# Altium schematic sheet Data-Power.SchDoc
size Letter; SheetNumber: 3; SheetTotal: 3; SPICEModelCacheLQOFTWCY: <root> / <DocumentId>LQOFTWCY</DocumentId> / </root>; SheetName: Data & Power
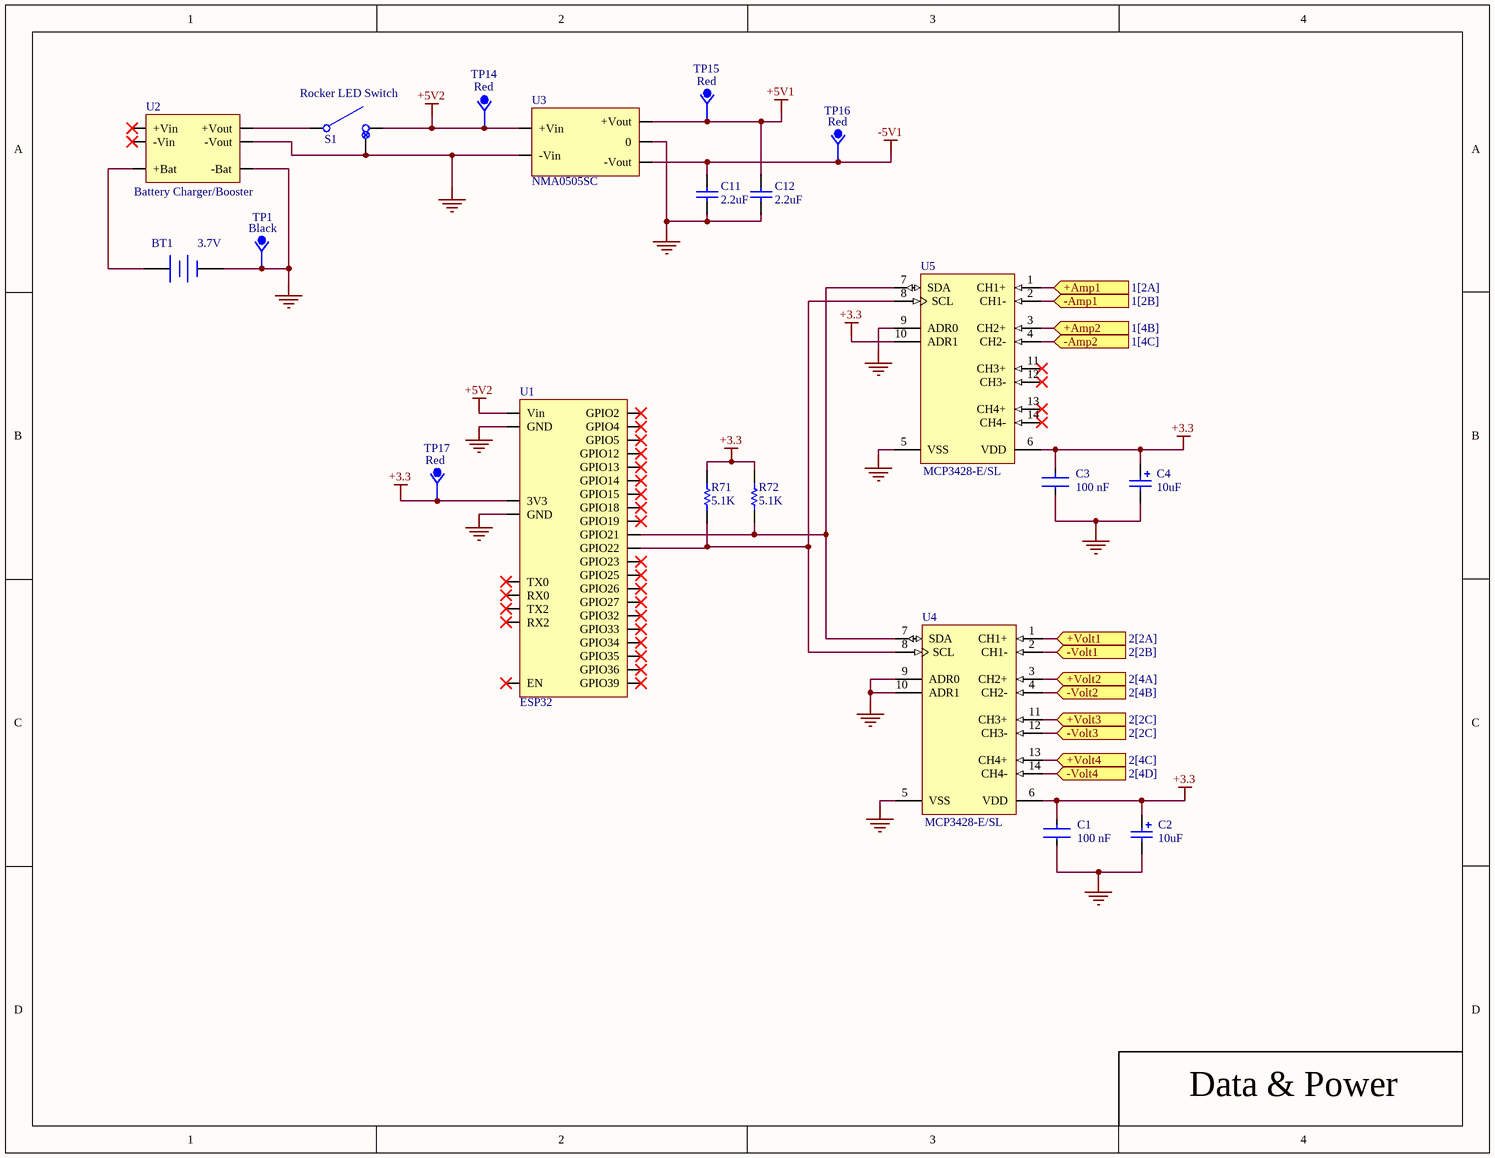
[diagram p0: Data-Power.SchDoc]

## Parts
BT1  Voltage: 3.7V  [BAT-2]  (hidden comment: 3.7V Battery)
C1  value 100 nF  [FP-CC0805-0_85-MFG]  (hidden comment: 100nF)
C2  value 10uF  [0805 Tant Cap]  (hidden comment: TCTP1C106M8R)
C3  value 100 nF  [FP-CC0805-0_85-MFG]  (hidden comment: 100nF)
C4  value 10uF  [0805 Tant Cap]  (hidden comment: TCTP1C106M8R)
C11  2.2uF  [CAPC2013X135X50ML10T20]
C12  2.2uF  [CAPC2013X135X50ML10T20]
R71  value 5.1K  [0805 Res]  (hidden comment: 5.11k Ohm)
R72  value 5.1K  [0805 Res]  (hidden comment: 5.11k Ohm)
S1  Rocker LED Switch  [SW]
TP1  Color: Black  [BlackTP]  (hidden comment: TP (Black))
TP14  Color: Red  [RedTP]  (hidden comment: TP (Red))
TP15  Color: Red  [RedTP]  (hidden comment: TP (Red))
TP16  Color: Red  [RedTP]  (hidden comment: TP (Red))
TP17  Color: Red  [RedTP]  (hidden comment: TP (Red))
U1  ESP32  [ESP32]
U2  Battery Charger/Booster  [Batt Chrg/Bst]
U3  DC DC Converter  [NMA0505SC]  (value not drawn)
U4  Manufacturer Part Number: MCP3428-E/SL  [SOIC-SL14_N]  (hidden comment: 4Ch ADC)
U5  Manufacturer Part Number: MCP3428-E/SL  [SOIC-SL14_N]  (hidden comment: 4Ch ADC)

## Ports
+Amp1 (in, see 1[2A]), +Amp2 (in, see 1[4B]), +Volt1 (in, see 2[2A]), +Volt2 (in, see 2[4A]), +Volt3 (in, see 2[2C]), +Volt4 (in, see 2[4C]), -Amp1 (in, see 1[2B]), -Amp2 (in, see 1[4C]), -Volt1 (in, see 2[2B]), -Volt2 (in, see 2[4B]), -Volt3 (in, see 2[2C]), -Volt4 (in, see 2[4D])

## Nets
+3.3: C1.1 C2.1 C3.1 C4.1 R71.2 R72.2 TP17.1(TP) U1.?3(3V3) U4.6(VDD) U5.6(VDD) U5.10(ADR1)
+5V1: C12.2 TP15.1(TP) U3.?4(+Vout)
+5V2: S1.?2 TP14.1(TP) U1.?1(Vin) U3.?1(+Vin)
-5V1: C11.2 TP16.1(TP) U3.?5(-Vout)
GND: BT1.2(-) C1.2 C2.2 C3.2 C4.2 C11.1 C12.1 S1.?3 TP1.1(TP) U1.?2(GND) U1.?4(GND) U2.?2(-Bat) U2.?4(-Vout) U3.?2(-Vin) U3.?3(0) U4.5(VSS) U4.9(ADR0) U4.10(ADR1) U5.5(VSS) U5.9(ADR0)
+Amp1: U5.1(CH1+) ; port +Amp1
+Amp2: U5.3(CH2+) ; port +Amp2
+Volt1: U4.1(CH1+) ; port +Volt1
+Volt2: U4.3(CH2+) ; port +Volt2
+Volt3: U4.11(CH3+) ; port +Volt3
+Volt4: U4.13(CH4+) ; port +Volt4
-Amp1: U5.2(CH1-) ; port -Amp1
-Amp2: U5.4(CH2-) ; port -Amp2
-Volt1: U4.2(CH1-) ; port -Volt1
-Volt2: U4.4(CH2-) ; port -Volt2
-Volt3: U4.12(CH3-) ; port -Volt3
-Volt4: U4.14(CH4-) ; port -Volt4
NetBT1_1: BT1.1(+) U2.?1(+Bat)
NetR71_1: R71.1 U1.39(GPIO22) U4.8(SCL) U5.8(SCL)
NetR72_1: R72.1 U1.42(GPIO21) U4.7(SDA) U5.7(SDA)
NetS1_?1: S1.?1 U2.?3(+Vout)

Not connected (* = marked no-connect by the designer): U1 5(GPIO36)* 8(GPIO39)* 9(EN)* 10(GPIO34)* 11(GPIO35)* 12(GPIO32)* 13(GPIO33)* 14(GPIO25)* 15(GPIO26)* 16(GPIO27)* 17(GPIO14)* 18(GPIO12)* 20(GPIO13)* 21(GPIO15)* 22(GPIO2)* 24(GPIO4)* 25(RX2)* 27(TX2)* 34(GPIO5)* 35(GPIO18)* 36(GPIO23)* 38(GPIO19)* 40(RX0)* 41(TX0)*; U2 ?5(+Vin)* ?6(-Vin)*; U5 11(CH3+)* 12(CH3-)* 13(CH4+)* 14(CH4-)*

## Library data of the parts
BT1 = Battery: 3.7V 1000mAh Battery with Protection Board; Manufacturer: Amazon(MakerFocus); Manufacturer Part Number: B07CXNQ3ZR; Published: 24-Mar-1999; LatestRevisionDate: 17-Jul-2002; LatestRevisionNote: Re-released for DXP Platform.; PackageReference: BAT-2; Publisher: Altium Limited; PackageDescription: Battery; 2 Leads
C1 C3 = CMP-1036-04402-6: CAP CER 0.1UF 16V X7R 0805; Manufacturer Part Number: CC0805KRX7R7BB104; Manufacturer: Yageo; Material: Ceramic; Tolerance: 0.1; Temperature: -30°C to +85°C; Lead Free: Yes; Footprint Url: http://www.yageo.com/exep/pages/download/literatures/UPY-C_GEN_24.pdf; Voltage Rating: 16 V; Package: CC0805-0.85; RoHS: TRUE; Digikey Description: CAP CER 0.1UF 16V X7R 0805; Category: Cap; Octopart: https://octopart.com/cc0805krx7r7bb104-yageo-39467769; Capacitance: 100 nF; Device Class L3: Ceramic Capacitors; ComponentLink2URL: http://www.yageo.com/documents/recent/UPY-GPHC_Y5V_6.3V-to-50V_8.pdf; Temperature Range Low: -30°C; Mouser Description: Multilayer Ceramic Capacitors MLCC - SMD/SMT 100nF 16V X7R 10%; Automotive: No; Device Class L2: Capacitors; Height: 0.95mm; ComponentLink2Description: Datasheet; Temperature Characteristic: X7R; Ipc Land Pattern Name: CAPC200125X85; Device Class L1: Passive Components; Temperature Range High: +85°C
C2 C4 = Cap Pol2: Cap Tant 10UF 20% 16V 0805; Manufacturer: Kyocera AVX; Published: 8-Jun-2000; LatestRevisionDate: 17-Jul-2002; LatestRevisionNote: Re-released for DXP Platform.; PackageReference: POLAR0.8; Publisher: Altium Limited; PackageDescription: Polarized Capacitor; 2 Leads; Supplier 1: Digikey; Supplier Part Number 1: 478-TCTP1C106M8RCT-ND; Manufacturer Part Number: TCTP1C106M8R; RoHS: No; Category: Tantalum Capacitors; Stock 1: 17395; Pricing 1: 1=0.8, 10=0.512, 50=0.3954, 100=0.3578, 500=0.29124, 1000=0.26947 (USD); ComponentLink1URL: https://datasheet.octopart.com/TCTP1C106M8R-KYOCERA-AVX-datasheet-165512328.pdf?src-supplier=Future+Electronics; ComponentLink1Description: https://datasheet.octopart.com/TCTP1C106M8R-KYOCERA-AVX-datasheet-165512328.pdf?src-supplier=Future+Electronics
C11 C12 = CMP-2007-03455-1: Ceramic Capacitor, Multilayer, Ceramic, 16V, 10% +Tol, 10% -Tol, X7R, 15% TC, 2.2uF, Surface Mount, 0805; Manufacturer: Murata; Manufacturer Part Number: GRM21BR71C225KA12L; Multilayer: Yes; Supplier 1: Mouser; Supplier Part Number 1: 81-GRM21BR71C225KA2L; RoHS: Yes; Category: Ceramic Capacitors; Stock 1: 24749; Pricing 1: 1=0.33, 10=0.141, 50=0.141, 100=0.095, 1000=0.07, 10000=0.054 (USD); Mounting Technology: Surface Mount; Pins: 2; Dielectric Material: Ceramic; Package Shape: Rectangular; Case/Package: 0805; Terminal Finish: Nickel; Min Operating Temperature: -55°C; Max Operating Temperature: 125°C; JESD-609 Code: e3; Value: 2.2uF; Capacitor Type: Ceramic; Tolerance  (fill in as +-): 10%; Package Style: SMTMeter; Packaging: Tape and Reel; Tolerance (fill in as +-): 10%; Rated DC Voltage (URdc): 16V; Temperature Characteristics Code: X7R; Termination: Wraparound; Length: 2mm; Width: 1.25mm; Height: 1.25mm; Reach SVHC Compliant: Yes; RoHS Compliant: Yes; ComponentLink1URL: https://datasheet.ciiva.com:443/pdfs/VipMasterIC/IC/MURE/MURE-S-A0004349797/MURE-S-A0004361718-1.pdf?src-supplier=IHS+Markit; ComponentLink1Description: https://datasheet.ciiva.com:443/pdfs/VipMasterIC/IC/MURE/MURE-S-A0004349797/MURE-S-A0004361718-1.pdf?src-supplier=IHS+Markit
R71 R72 = Res1: Fixed Resistor, Metal Glaze/thick Film, 0.125W, 5110ohm, 150V, 1% +/-Tol, 100ppm/Cel, Surface Mount, 0805; Manufacturer: Stackpole Electronics; Manufacturer Part Number: RMCF0805FT5K11; Power: 125mW; Rated Temperature: 70°C; Temperature Coefficient (ppm/Cel): 100; Package Height: 0.5mm; Package Length: 2mm; Package Width: 1.25mm; Reference Standard: AEC-Q200; Published: 8-Jun-2000; LatestRevisionDate: 17-Jul-2002; LatestRevisionNote: Re-released for DXP Platform.; PackageReference: AXIAL-0.3; Publisher: Altium Limited; PackageDescription: Axial Device, Thru-Hole; 2 Leads; 0.3 in Pin Spacing; Supplier 1: Avnet; Supplier Part Number 1: RMCF0805FT5K11; RoHS: Yes; Category: Chip SMD Resistors; Stock 1: 255000; Pricing 1: 5000=0.00252, 10000=0.00248, 20000=0.00245, 30000=0.00241, 40000=0.00238 (USD); Mounting Technology: Surface Mount; Pins: 2; Package Shape: Rectangular; Case/Package: 0805; Terminal Finish: Nickel; Min Operating Temperature: -55°C; Max Operating Temperature: 155°C; Tolerance: 1%; JESD-609 Code: e3; Resistor Type: FIXED RESISTOR; Construction: Rectangular; Packaging: Tape and Reel; Technology: METAL GLAZE/THICK FILM; Termination: Wraparound; Working Voltage: 150V; Reach SVHC Compliant: Yes; RoHS Compliant: Yes; ComponentLink1URL: https://datasheet.ciiva.com:443/pdfs/VipMasterIC/IC/SEIE/SEIE-S-A0009541969/SEIE-S-A0009541969-1.pdf?src-supplier=IHS+Markit; ComponentLink1Description: https://datasheet.ciiva.com:443/pdfs/VipMasterIC/IC/SEIE/SEIE-S-A0009541969/SEIE-S-A0009541969-1.pdf?src-supplier=IHS+Markit; ComponentLink2URL: https://datasheet.ciiva.com/15193/getdatasheetpartid-409010-15193607.pdf?src-supplier=Verical; ComponentLink2Description: https://datasheet.ciiva.com/15193/getdatasheetpartid-409010-15193607.pdf?src-supplier=Verical
S1 = SW: Single-Pole, Single-Throw Rocket LED Switch; Manufacturer: Amazon(Nilight); Manufacturer Part Number: B07T1JG6BD
TP1 = TP: Black Test Point; Manufacturer: Keystone; Manufacturer P/N: 5001; Description: Interconnection Device; Supplier 1: Mouser; Supplier Part Number 1: 534-5001; Manufacturer Part Number: 5001; RoHS: Yes; Category: Connectors; Stock 1: 345950; Pricing 1: 1=0.29, 10=0.29, 25=0.262, 50=0.262, 100=0.222, 500=0.184, 1000=0.173, 2500=0.154, 5000=0.143, 10000=0.143 (USD); Contact Finish - Termination: Silver (Ag); JESD-609 Code: e4; Connector Type: Interconnection Device; Reach SVHC Compliant: Yes; RoHS Compliant: Yes; ComponentLink1URL: https://datasheet.ciiva.com:443/pdfs/VipMasterIC/IC/KEYC/KEYCS01036/KEYCS02044-1.pdf?src-supplier=IHS+Markit; ComponentLink1Description: https://datasheet.ciiva.com:443/pdfs/VipMasterIC/IC/KEYC/KEYCS01036/KEYCS02044-1.pdf?src-supplier=IHS+Markit; ComponentLink2URL: https://datasheet.ciiva.com/11836/0900766b8009b7c7-11836045.pdf?src-supplier=Rs; ComponentLink2Description: https://datasheet.ciiva.com/11836/0900766b8009b7c7-11836045.pdf?src-supplier=Rs; ComponentLink3URL: https://datasheet.ciiva.com/27052/1581986-27052611.pdf?src-supplier=Jameco; ComponentLink3Description: https://datasheet.ciiva.com/27052/1581986-27052611.pdf?src-supplier=Jameco; ComponentLink4URL: https://datasheet.ciiva.com/22631/1703983-22631100.pdf?src-supplier=Element14; ComponentLink4Description: https://datasheet.ciiva.com/22631/1703983-22631100.pdf?src-supplier=Element14; ComponentLink5URL: https://datasheet.ciiva.com/16318/m60-2p60-16318423.pdf?src-supplier=Future+Electronics; ComponentLink5Description: https://datasheet.ciiva.com/16318/m60-2p60-16318423.pdf?src-supplier=Future+Electronics
TP14-TP17 = TP: Red Test Point; Manufacturer: Keystone; Manufacturer Part Number: 5000; Description: Interconnection Device; Supplier 1: Mouser; Supplier Part Number 1: 534-5000; RoHS: Yes; Category: Connectors; Stock 1: 320297; Pricing 1: 1=0.29, 10=0.29, 50=0.262, 100=0.222, 1000=0.173, 10000=0.143 (USD); Contact Finish - Termination: Silver (Ag); JESD-609 Code: e4; Connector Type: Interconnection Device; Reach SVHC Compliant: Yes; RoHS Compliant: Yes; ComponentLink1URL: https://datasheet.ciiva.com:443/pdfs/VipMasterIC/IC/KEYC/KEYCS01036/KEYCS02044-1.pdf?src-supplier=IHS+Markit; ComponentLink1Description: https://datasheet.ciiva.com:443/pdfs/VipMasterIC/IC/KEYC/KEYCS01036/KEYCS02044-1.pdf?src-supplier=IHS+Markit; ComponentLink2URL: https://datasheet.ciiva.com/11836/0900766b8009b7c7-11836046.pdf?src-supplier=Rs; ComponentLink2Description: https://datasheet.ciiva.com/11836/0900766b8009b7c7-11836046.pdf?src-supplier=Rs
U1 = ESP32: ESP-WROOM-32 ESP32 ESP-32S Development Board 2.4GHz Dual-Mode WiFi + Bluetooth Dual Cores Microcontroller Processor Integrated with Antenna RF AMP Filter AP STA; Manufacturer: Amazon(AITRIP); Manufacturer Part Number: B08D5ZD528
U2 = Booster/Charger: Lithium Battery Fast Charging Boost Mobile Power Protection PCB Board; Manufacturer: Amazon(AEDIKO); Manufacturer Part Number: B09X9VMGV4
U3 = NMA0505SC: DC DC CONVERTER +/-5V 1W; Manufacturer: Murata; Manufacturer Part Number: NMA0505SC
U4 = CMP-0188-01159-1: 16-Bit, Multi-Channel Delta-Sigma Analog-to-Digital Converter with I2C Interface and On-Board Reference, 14-Pin SOIC 150mil, Extended Temperature; Manufacturer: Microchip Tech; Address: 000; DatasheetVersion: revA, Dec-2009; ComponentLink2URL: http://ww1.microchip.com/downloads/en/DeviceDoc/22226a.pdf; ComponentLink1URL: http://www.microchip.com/; PackageVersion: revBB, Aug-2009; ComponentLink2Description: Datasheet; PackageReference: SOIC-SL14; PackageDescription: 14-Lead Plastic Small Outline (SL) - Narrow, 3.90mm Body [SOIC]; ComponentLink3URL: http://www.microchip.com/stellent/groups/techpub_sg/documents/packagingspec/en012702.pdf; ComponentLink1Description: Manufacturer URL; Code_IPC: SOIC127P600-14; Code_JEDEC: MS-012-AB; ComponentLink3Description: Package Specification
U5 = CMP-0188-01159-1: 16-Bit, Multi-Channel Delta-Sigma Analog-to-Digital Converter with I2C Interface and On-Board Reference, 14-Pin SOIC 150mil, Extended Temperature; Manufacturer: Microchip Tech; Address: 010; DatasheetVersion: revA, Dec-2009; ComponentLink2URL: http://ww1.microchip.com/downloads/en/DeviceDoc/22226a.pdf; ComponentLink1URL: http://www.microchip.com/; PackageVersion: revBB, Aug-2009; ComponentLink2Description: Datasheet; PackageReference: SOIC-SL14; PackageDescription: 14-Lead Plastic Small Outline (SL) - Narrow, 3.90mm Body [SOIC]; ComponentLink3URL: http://www.microchip.com/stellent/groups/techpub_sg/documents/packagingspec/en012702.pdf; ComponentLink1Description: Manufacturer URL; Code_IPC: SOIC127P600-14; Code_JEDEC: MS-012-AB; ComponentLink3Description: Package Specification